# Altium schematic sheet USB3.0_1.SchDoc
size A3; SheetNumber: 16; SheetTotal: 18
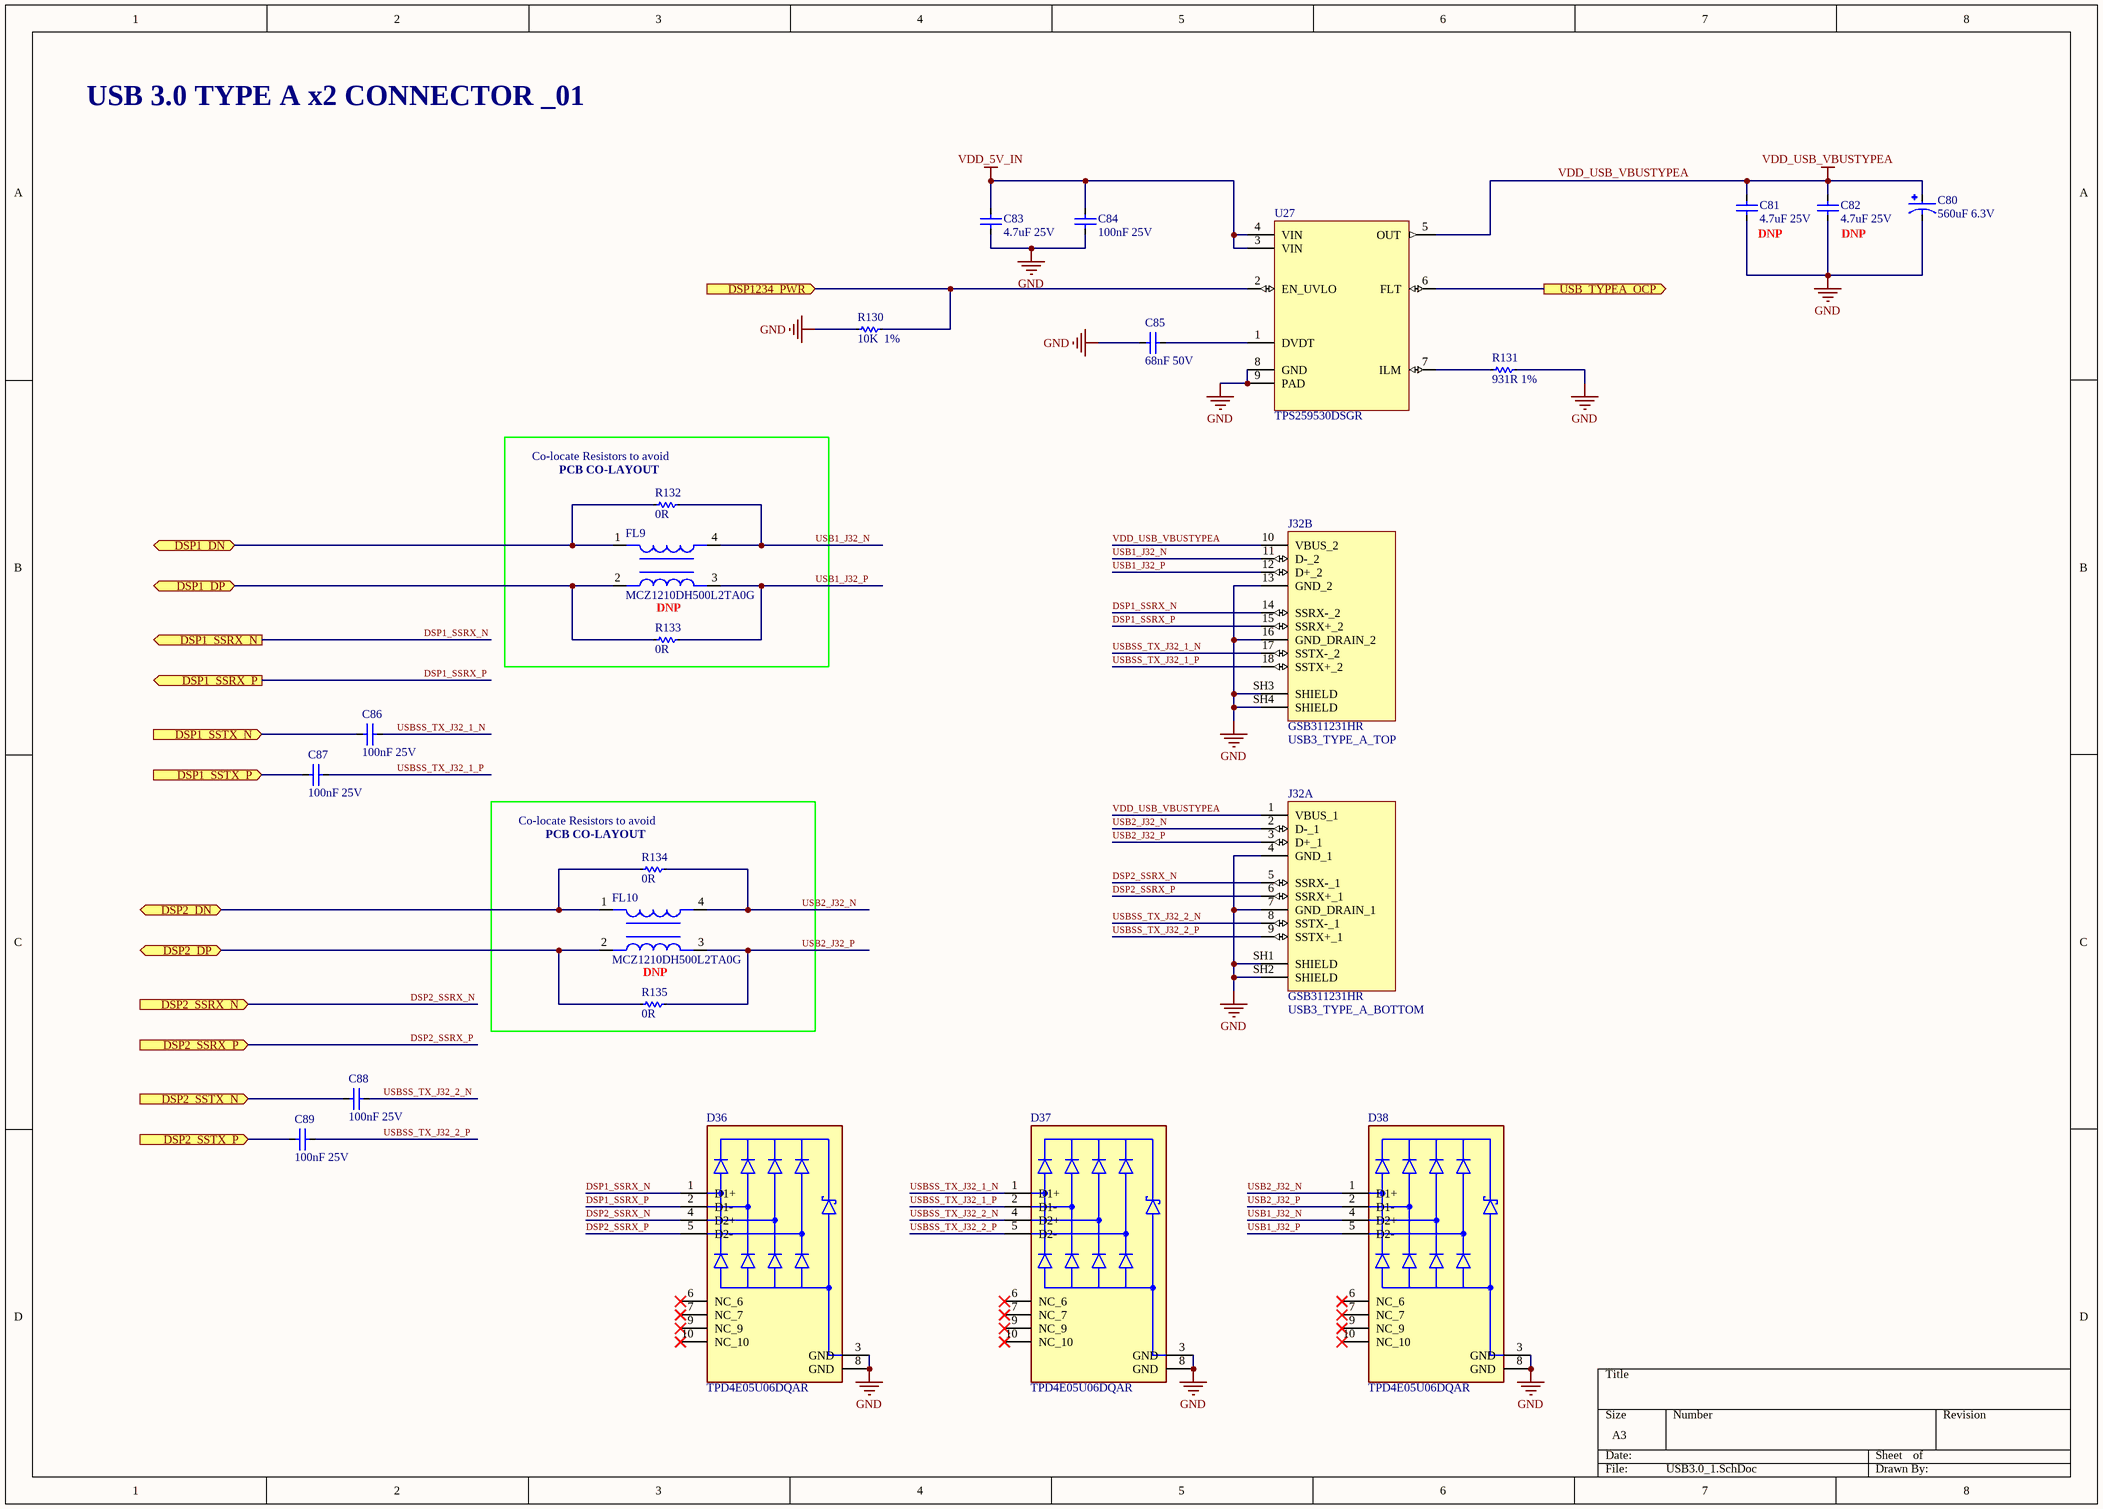
[diagram p0: USB3.0_1.SchDoc]

## Parts
C80  560uF 6.3V  [CP_ELEC_8X7.7]
C81  4.7uF 25V  [C0603]
C82  4.7uF 25V  [C0603]
C83  4.7uF 25V  [C0603]
C84  100nF 25V  [C0402]
C85  68nF 50V  [C0805]
C86  100nF 25V  [C0402]
C87  100nF 25V  [C0402]
C88  100nF 25V  [C0402]
C89  100nF 25V  [C0402]
D36  TPD4E05U06DQAR  [TPD4E05U06DQAR]
D37  TPD4E05U06DQAR  [TPD4E05U06DQAR]
D38  TPD4E05U06DQAR  [TPD4E05U06DQAR]
FL9  MCZ1210DH500L2TA0G  [MCZ1210DH500L2TA0G]
FL10  MCZ1210DH500L2TA0G  [MCZ1210DH500L2TA0G]
J32  GSB311231HR  [GSB311231HR]  (parts A,B of 2)
R130  10K  1%  [R0402]
R131  931R 1%  [R0402]
R132  0R  [R0402]
R133  0R  [R0402]
R134  0R  [R0402]
R135  0R  [R0402]
U27  TPS259530DSGR  [WSON(2X2)-8]

## Ports
DSP1_DN (bidir), DSP1_DP (bidir), DSP1_SSRX_N (out), DSP1_SSRX_P (out), DSP1_SSTX_N (in), DSP1_SSTX_P (in), DSP2_DN (bidir), DSP2_DP (bidir), DSP2_SSRX_N (in), DSP2_SSRX_P (in), DSP2_SSTX_N (in), DSP2_SSTX_P (in), DSP1234_PWR (in), USB_TYPEA_OCP (out)

## Nets
GND: C80.2(C) C81.1 C82.1 C83.1 C84.1 C85.1 D36.3(GND) D36.8(GND) D37.3(GND) D37.8(GND) D38.3(GND) D38.8(GND) J32.4(GND_1) J32.7(GND_DRAIN_1) J32.13(GND_2) J32.16(GND_DRAIN_2) J32.SH1(SHIELD) J32.SH2(SHIELD) J32.SH3(SHIELD) J32.SH4(SHIELD) R130.1 R131.2 U27.8(GND) U27.9(PAD)
VDD_5V_IN: C83.2 C84.2 U27.3(VIN) U27.4(VIN)
VDD_USB_VBUSTYPEA: C80.1(A) C81.2 C82.2 J32.1(VBUS_1) J32.10(VBUS_2) U27.5(OUT)
DSP1_DN: FL9.1 R132.1 ; port DSP1_DN
DSP1_DP: FL9.2 R133.1 ; port DSP1_DP
DSP1_SSRX_N: D36.1(D1+) J32.14(SSRX-_2) ; port DSP1_SSRX_N
DSP1_SSRX_P: D36.2(D1-) J32.15(SSRX+_2) ; port DSP1_SSRX_P
DSP1_SSTX_N: C86.1 ; port DSP1_SSTX_N
DSP1_SSTX_P: C87.1 ; port DSP1_SSTX_P
DSP2_DN: FL10.1 R134.1 ; port DSP2_DN
DSP2_DP: FL10.2 R135.1 ; port DSP2_DP
DSP2_SSRX_N: D36.4(D2+) J32.5(SSRX-_1) ; port DSP2_SSRX_N
DSP2_SSRX_P: D36.5(D2-) J32.6(SSRX+_1) ; port DSP2_SSRX_P
DSP2_SSTX_N: C88.1 ; port DSP2_SSTX_N
DSP2_SSTX_P: C89.1 ; port DSP2_SSTX_P
DSP1234_PWR: R130.2 U27.2(EN_UVLO) ; port DSP1234_PWR
USB1_J32_N: D38.4(D2+) FL9.4 J32.11(D-_2) R132.2
USB1_J32_P: D38.5(D2-) FL9.3 J32.12(D+_2) R133.2
USB2_J32_N: D38.1(D1+) FL10.4 J32.2(D-_1) R134.2
USB2_J32_P: D38.2(D1-) FL10.3 J32.3(D+_1) R135.2
USB_TYPEA_OCP: U27.6(FLT) ; port USB_TYPEA_OCP
USBSS_TX_J32_1_N: C86.2 D37.1(D1+) J32.17(SSTX-_2)
USBSS_TX_J32_1_P: C87.2 D37.2(D1-) J32.18(SSTX+_2)
USBSS_TX_J32_2_N: C88.2 D37.4(D2+) J32.8(SSTX-_1)
USBSS_TX_J32_2_P: C89.2 D37.5(D2-) J32.9(SSTX+_1)
NetC85_2: C85.2 U27.1(DVDT)
NetR131_1: R131.1 U27.7(ILM)

Not connected (* = marked no-connect by the designer): D36 6(NC_6)* 7(NC_7)* 9(NC_9)* 10(NC_10)*; D37 6(NC_6)* 7(NC_7)* 9(NC_9)* 10(NC_10)*; D38 6(NC_6)* 7(NC_7)* 9(NC_9)* 10(NC_10)*

## Notes on the sheet
- USB 3.0 TYPE A x2 CONNECTOR _01
- (near C81) DNP
- (near C82) DNP
- (near R132) Co-locate Resistors to avoid
- (near R132) PCB CO-LAYOUT
- DNP
- (near J32) USB3_TYPE_A_TOP
- (near R134) Co-locate Resistors to avoid
- (near R134) PCB CO-LAYOUT
- (near J32) USB3_TYPE_A_BOTTOM

## Library data of the parts
C80 = RHA0J561MCN1GS: Cap Aluminum Polymer 560uF 6.3VDC 20% (8 X 7.7mm) SMD 0.009 Ohm 4500mA 2000h 105C T/R; Manufacturer: Nichicon; ESR (Equivalent Series Resistance): 9mR; Life (Hours): 2000Hour; Ripple Current: 4.5A; Leakage Current: 1.0584mA; Dissipation Factor: 0.12%; Supplier 1: Digi-Key; Manufacturer Part Number: RHA0J561MCN1GS; RoHS: Yes; Category: Polymer Capacitors; Stock 1: 37081; Pricing 1: 1=1.16000, 10=0.88500, 50=0.73500, 100=0.63290 (USD); Mount: Surface Mount; Case/Package: Radial; Min Operating Temperature: -55°C; Max Operating Temperature: 105°C; Capacitance: 560uF; Tolerance: 20%; Voltage Rating: 6.3V; Packaging: Tape and Reel; Package Quantity: 1; Voltage Rating (DC): 6.3V; Termination: SMD/SMT; Series: FPCAP, HA; Construction: Cylindrical; Diameter: 8mm; Length: 7.7mm; Width: 8.3mm; Height: 8.3mm; Height - Seated (Max): 0.303inch; Radiation Hardening: No; RoHS Compliant: Yes; ComponentLink1URL: https://datasheet.ciiva.com/16481/2009fpcap-catalog-hsha-16481370.pdf?src-supplier=Future+Electronics; ComponentLink1Description: https://datasheet.ciiva.com/16481/2009fpcap-catalog-hsha-16481370.pdf?src-supplier=Future+Electronics; ComponentLink2URL: https://datasheet.ciiva.com/101/e-hs-ha-101946.pdf?src-supplier=Digi-Key; ComponentLink2Description: https://datasheet.ciiva.com/101/e-hs-ha-101946.pdf?src-supplier=Digi-Key; ComponentLink3URL: https://datasheet.ciiva.com/101/e-hs-ha-101947.pdf?src-supplier=Digi-Key; ComponentLink3Description: https://datasheet.ciiva.com/101/e-hs-ha-101947.pdf?src-supplier=Digi-Key; ComponentLink4URL: https://datasheet.ciiva.com/101/e-hs-ha-101948.pdf?src-supplier=Digi-Key; ComponentLink4Description: https://datasheet.ciiva.com/101/e-hs-ha-101948.pdf?src-supplier=Digi-Key; Supplier Part Number 1: 493-3772-1-ND
C81-C83 = GRM188R61E475KE11D: 0603 4.7 uF 25 V ±10 % Tolerance X5R SMT Multilayer Ceramic Capacitor; Manufacturer: Murata; Tolerance: 10%; Supplier 1: Digi-Key; Manufacturer Part Number: GRM188R61E475KE11D; RoHS: Yes; Category: Ceramic Capacitors; Stock 1: 1144167; Pricing 1: 1=0.26000, 10=0.18000, 50=0.12000, 100=0.10200, 500=0.07202, 1000=0.06301 (USD); Mount: Surface Mount; Case/Package: 0603; Case Code (Metric): 1608; Case Code (Imperial): 0603; Material: Ceramic; Min Operating Temperature: -55°C; Max Operating Temperature: 85°C; Package Quantity: 1; Packaging: Cut Tape; Capacitance: 4.7uF; Voltage Rating: 25V; Dielectric: X5R; Voltage: 25V; Voltage Rating (DC): 25V; Series: GRM; Length: 0.063inch; Width: 0.031inch; Height: 0.8mm; Thickness: 0.031inch; Depth: 0.8mm; Reach SVHC Compliant: Yes; Lead Free: Lead Free; RoHS Compliant: Yes; ComponentLink1URL: https://datasheet.ciiva.com/46444/1769893-46444983.pdf?src-supplier=Element14; ComponentLink1Description: https://datasheet.ciiva.com/46444/1769893-46444983.pdf?src-supplier=Element14; ComponentLink2URL: https://datasheet.ciiva.com/46444/1769893-46444982.pdf?src-supplier=Element14; ComponentLink2Description: https://datasheet.ciiva.com/46444/1769893-46444982.pdf?src-supplier=Element14; ComponentLink3URL: https://datasheet.ciiva.com/14891/partnumbering-e-01-14891103.pdf?src-supplier=Digi-Key; ComponentLink3Description: https://datasheet.ciiva.com/14891/partnumbering-e-01-14891103.pdf?src-supplier=Digi-Key; ComponentLink4URL: https://datasheet.ciiva.com/14891/partnumbering-e-01-14891102.pdf?src-supplier=Digi-Key; ComponentLink4Description: https://datasheet.ciiva.com/14891/partnumbering-e-01-14891102.pdf?src-supplier=Digi-Key; Supplier Part Number 1: 490-7203-1-ND
C84 = TMK105BJ104KV-F: CAP CER 0.1UF 25V X5R 0402 / High Value Multilayer Ceramic Capacitors (High dielectric type); Manufacturer: Taiyo Yuden; Tolerance: 10%; Supplier 1: Digi-Key; Manufacturer Part Number: TMK105BJ104KV-F; RoHS: Yes; Category: Ceramic Capacitors; Stock 1: 11997960; Pricing 1: 1=0.10000, 10=0.03700, 50=0.02000, 100=0.01630, 500=0.01166, 1000=0.00917, 2500=0.00833, 5000=0.00767 (USD); Mount: Surface Mount; Case/Package: 0402; Number of Pins: 2; Case Code (Imperial): 0402; Case Code (Metric): 1005; Weight: 2.3E-05oz; Min Operating Temperature: -55°C; Max Operating Temperature: 85°C; Capacitance: 100nF; Packaging: Tape and Reel; Dielectric: X5R; Voltage Rating (DC): 25V; Voltage Rating: 25V; Package Quantity: 1; Termination: SMD/SMT; Resistor Type: Ceramic; Voltage: 25V; Series: M; Construction: Flat; Length: 1mm; Width: 0.02inch; Height: 0.5mm; Depth: 0.5mm; Thickness: 0.022inch; Reach SVHC Compliant: Yes; Lead Free: Lead Free; Halogen Free: Halogen Free; RoHS Compliant: Yes; Supplier Part Number 1: 587-1456-1-ND
C85 = C0805C683K5RECAUTO7210: Cap Cer 0805 68NF 50V X7R 10%; Manufacturer: KEMET; Supplier 1: Digi-Key; Manufacturer Part Number: C0805C683K5RECAUTO7210; Category: Ceramic Capacitors; Stock 1: 10000; Pricing 1: 1=0.25000, 10=0.17100, 50=0.11400, 100=0.09680, 500=0.06836, 1000=0.05981, 2500=0.05696, 5000=0.05269 (USD); RoHS Compliant: Yes; ComponentLink1URL: https://api.kemet.com/component-edge/download/datasheet/C0805C683K5RECAUTO7210.pdf?src-supplier=Digi-Key; ComponentLink1Description: https://api.kemet.com/component-edge/download/datasheet/C0805C683K5RECAUTO7210.pdf?src-supplier=Digi-Key; Supplier Part Number 1: 399-C0805C683K5RECAUTO7210CT-ND
C86-C89 = 04023C104KAT2A: 0402 100 nF 25 V ±10 % Tolerance X7R Surface Mount Multilayer Ceramic Capacitor; Manufacturer: Kyocera AVX; Tolerance: 10%; Supplier 1: Digi-Key; Manufacturer Part Number: 04023C104KAT2A; RoHS: Yes; Category: Ceramic Capacitors; Stock 1: 3248475; Pricing 1: 1=0.10000, 10=0.03300, 50=0.01820, 100=0.01480, 500=0.01060, 1000=0.00833, 2500=0.00758, 5000=0.00697 (USD); Mount: Surface Mount; Case/Package: 0402; Number of Pins: 2; Case Code (Metric): 1005; Case Code (Imperial): 0402; Min Operating Temperature: -55°C; Max Operating Temperature: 125°C; Capacitance: 100nF; Packaging: Cut Tape; Dielectric: X7R; Voltage Rating (DC): 25V; Voltage Rating: 25V; Package Quantity: 1; Termination: SMD/SMT; Voltage: 25V; Series: -; Construction: Flat; Length: 1mm; Width: 1mm; Thickness: 0.022inch; Depth: 0.5mm; Radiation Hardening: No; Reach SVHC Compliant: Yes; Lead Free: Lead Free; RoHS Compliant: Yes; ComponentLink1URL: https://datasheet.ciiva.com/1123/1679506-1123344.pdf?src-supplier=Element14; ComponentLink1Description: https://datasheet.ciiva.com/1123/1679506-1123344.pdf?src-supplier=Element14; ComponentLink2URL: https://datasheet.ciiva.com/7614/cx7r-7614663.pdf?src-supplier=Digi-Key; ComponentLink2Description: https://datasheet.ciiva.com/7614/cx7r-7614663.pdf?src-supplier=Digi-Key; ComponentLink3URL: https://datasheet.ciiva.com/7709/1679506-7709527.pdf?src-supplier=Element14; ComponentLink3Description: https://datasheet.ciiva.com/7709/1679506-7709527.pdf?src-supplier=Element14; ComponentLink4URL: https://datasheet.ciiva.com/6265/cx7r-6265272.pdf?src-supplier=Digi-Key; ComponentLink4Description: https://datasheet.ciiva.com/6265/cx7r-6265272.pdf?src-supplier=Digi-Key; ComponentLink5URL: https://datasheet.ciiva.com/14906/cx7r-14906223.pdf?src-supplier=Digi-Key; ComponentLink5Description: https://datasheet.ciiva.com/14906/cx7r-14906223.pdf?src-supplier=Digi-Key; Supplier Part Number 1: 478-7868-1-ND
D36-D38 = TPD4E05U06DQAR: Quad 0.5-pF, 5.5-V, ±12-kV ESD protection diode for USB, HDMI & High Speed Interfaces; Manufacturer: Texas Instruments; Direction: Unidirectional; Capacitance: 0.5pF; Number of Bidirectional Channels: 4; Reverse Standoff Voltage: 5.5V; Min Breakdown Voltage: 6V; Clamping Voltage: 14V; Peak Pulse Power: 40W; Power Line Protection: Yes; Leakage Current: 10nA; Peak Pulse Current: 2.5A; Interface: LVDS,USB,Ethernet,HDMI,PCIe,SATA; Supplier 1: Mouser; Manufacturer Part Number: TPD4E05U06DQAR; RoHS: Yes; Category: Integrated Circuits (ICs); Stock 1: 71744; Pricing 1: 1=0.66000, 10=0.58100, 50=0.54600, 100=0.44600, 1000=0.28200, 10000=0.25500 (USD); Mount: Surface Mount; Case/Package: SON; Number of Pins: 10; Contact Plating: Gold; Min Operating Temperature: -40°C; Max Operating Temperature: 125°C; Packaging: Tape and Reel; Package Quantity: 3000; Polarity: Unidirectional; Number of Channels: 4; Breakdown Voltage: 6V; Max Power Dissipation: 40W; Termination: SMD/SMT; Working Voltage: 5.5V; Operating Supply Voltage: 5.5V; Series: -; Number of Unidirectional Channels: 4; Length: 2.6mm; Depth: 1.1mm; Radiation Hardening: No; Reach SVHC Compliant: Yes; Lead Free: Lead Free; RoHS Compliant: Yes; ComponentLink1URL: https://datasheet.ciiva.com/15063/tpd4e05u06-15063653.pdf?src-supplier=Digi-Key; ComponentLink1Description: https://datasheet.ciiva.com/15063/tpd4e05u06-15063653.pdf?src-supplier=Digi-Key; ComponentLink2URL: https://datasheet.ciiva.com/24119/slvsbo7f-316827-24119436.pdf?src-supplier=Mouser; ComponentLink2Description: https://datasheet.ciiva.com/24119/slvsbo7f-316827-24119436.pdf?src-supplier=Mouser; ComponentLink3URL: https://datasheet.ciiva.com/26918/getdatasheetpartid-716763-26918024.pdf?src-supplier=Verical; ComponentLink3Description: https://datasheet.ciiva.com/26918/getdatasheetpartid-716763-26918024.pdf?src-supplier=Verical; ComponentLink4URL: https://datasheet.ciiva.com/15063/tpd4e05u06-15063654.pdf?src-supplier=Digi-Key; ComponentLink4Description: https://datasheet.ciiva.com/15063/tpd4e05u06-15063654.pdf?src-supplier=Digi-Key; ComponentLink5URL: https://datasheet.ciiva.com/15063/tpd4e05u06-15063655.pdf?src-supplier=Digi-Key; ComponentLink5Description: https://datasheet.ciiva.com/15063/tpd4e05u06-15063655.pdf?src-supplier=Digi-Key; ComponentLink6URL: https://datasheet.ciiva.com/29883/tpd4e05u06-29883798.pdf?src-supplier=Avnet; ComponentLink6Description: https://datasheet.ciiva.com/29883/tpd4e05u06-29883798.pdf?src-supplier=Avnet; Supplier Part Number 1: 595-TPD4E05U06DQAR
FL9 FL10 = MCZ1210DH500L2TA0G: 2 Line Common Mode Choke Surface Mount 50 Ohms 100mA DCR 2.5Ohm; Manufacturer: TDK; Number of Lines: 2; DC Resistance (DCR): 2.5R; Voltage Rating (DC): 5V; Supplier 1: Mouser; Manufacturer Part Number: MCZ1210DH500L2TA0G; RoHS: Yes; Category: Common Mode Chokes; Stock 1: 8170; Pricing 1: 1=0.64000, 10=0.62200, 50=0.62200, 100=0.49900, 1000=0.33900, 10000=0.24500 (USD); Mount: Surface Mount; Case Code (Metric): 3225; Case Code (Imperial): 1210; Min Operating Temperature: -40°C; Max Operating Temperature: 85°C; Packaging: Tape and Reel; Max Current Rating: 100mA; Length: 0.049inch; Width: 0.039inch; Height: 0.024inch; RoHS Compliant: Yes; ComponentLink1URL: https://product.tdk.com/info/en/catalog/datasheets/cmf_commercial_signal_mcz1210dh_en.pdf?ref_disty=digikey&src-supplier=Digi-Key; ComponentLink1Description: https://product.tdk.com/info/en/catalog/datasheets/cmf_commercial_signal_mcz1210dh_en.pdf?ref_disty=digikey&src-supplier=Digi-Key; Supplier Part Number 1: 810-MCZ1210DH500L2TG
J32 = GSB311231HR: 18 Position USB TYPE-A Panel Mount Through Hole Right Angle Receptacle Connector; Manufacturer: Amphenol Communications Solutions; Supplier 1: Digi-Key; Manufacturer Part Number: GSB311231HR; RoHS: No; Category: Connectors; Stock 1: 6819; Pricing 1: 1=3.39000, 10=3.08200, 25=2.91880, 40=2.85075, 100=2.71510, 300=2.37570, 500=2.30782, 1000=1.96843, 2400=1.83268 (USD); Supplier Part Number 1: GSB311231HR-ND; ComponentLink1Description: Datasheet; ComponentLink1URL: https://www.amphenol-cs.com/media/wysiwyg/files/drawing/gsb311231hr.pdf
R130 = RC0402FR-0710KP: Res General Purpose Thick Film 0402 10K Ohm 1% 1/16W ±100ppm/°C Molded SMD Paper T/R; Manufacturer: Yageo; Resistance: 10kR; Max Power Dissipation: 63mW; Temperature Coefficient: 150ppm/°C; Supplier 1: Digi-Key; Manufacturer Part Number: RC0402FR-0710KP; RoHS: Yes; Category: Chip SMD Resistors; Stock 1: 1032587; Pricing 1: 1=0.10000, 10=0.03100, 100=0.01280, 1000=0.00573, 2500=0.00497, 5000=0.00411 (USD); Case/Package: 0402; Case Code (Metric): 1005; Case Code (Imperial): 0402; Min Operating Temperature: -55°C; Max Operating Temperature: 155°C; Packaging: Tape and Reel; Resistor Type: Thick Film; Number of Terminations: 2; Tolerance: 1%; Features: Moisture Resistant; Length: 0.039inch; Width: 0.02inch; Height: 0.016inch; RoHS Compliant: Yes; ComponentLink1URL: http://www.yageo.com/NewPortal/yageodocoutput?fileName=/pdf/R-Chip/PYu-RC_51_RoHS_P_0.pdf&src-supplier=Digi-Key; ComponentLink1Description: http://www.yageo.com/NewPortal/yageodocoutput?fileName=/pdf/R-Chip/PYu-RC_51_RoHS_P_0.pdf&src-supplier=Digi-Key; Supplier Part Number 1: YAG1249CT-ND
R131 = RC0402FR-07931RL: Res Thick Film 0402 931 Ohm 1% 1/16W ±100ppm/°C Molded SMD Paper T/R; Manufacturer: Yageo; Voltage Rating: 50V; Power Rating: 62.5mW; Max Power Dissipation: 63mW; Supplier 1: Digi-Key; Manufacturer Part Number: RC0402FR-07931RL; RoHS: Yes; Category: Chip SMD Resistors; Stock 1: 184106; Pricing 1: 1=0.10000, 10=0.01400, 100=0.00580, 1000=0.00262, 2500=0.00228, 5000=0.00188 (USD); Case/Package: 0402; Case Code (Imperial): 0402; Case Code (Metric): 1005; Contact Plating: Tin,Matte; Size Code: 0402; Min Operating Temperature: -55°C; Max Operating Temperature: 155°C; Resistance: 931R; Tolerance: 1%; Packaging: Tape and Reel; Resistor Type: Thick Film; Number of Terminations: 2; Termination: SMD/SMT; Temperature Coefficient: 100ppm/°C; Voltage Rating (DC): 50V; Features: Moisture Resistant; Series: RC; Construction: Rectangular; Length: 1mm; Width: 0.02inch; Height: 0.016inch; Depth: 0.5mm; Military Standard: Not; Lead Free: Lead Free; RoHS Compliant: Yes; ComponentLink1URL: https://datasheet.ciiva.com/16931/pyu-rc0402-51-rohs-l-6-r-16931231.pdf?src-supplier=Future+Electronics; ComponentLink1Description: https://datasheet.ciiva.com/16931/pyu-rc0402-51-rohs-l-6-r-16931231.pdf?src-supplier=Future+Electronics; Supplier Part Number 1: YAG3259CT-ND
R132-R135 = RC0402JR-070RP: Res Jumper Thick Film 0402 0 Ohm 5% 1/16W Molded SMD Paper T/R; Manufacturer: Yageo; Resistance: 0mR; Max Power Dissipation: 63mW; Supplier 1: Digi-Key; Manufacturer Part Number: RC0402JR-070RP; RoHS: Yes; Category: Chip SMD Resistors; Stock 1: 5886851; Pricing 1: 1=0.10000, 10=0.02300, 25=0.01640, 50=0.01240, 100=0.00920, 250=0.00700, 500=0.00560, 1000=0.00412, 5000=0.00296 (USD); Case/Package: 0402; Case Code (Metric): 1005; Case Code (Imperial): 0402; Min Operating Temperature: -55°C; Max Operating Temperature: 155°C; Packaging: Tape and Reel; Resistor Type: Thick Film; Number of Terminations: 2; Features: Moisture Resistant; Length: 0.039inch; Width: 0.02inch; Height: 0.016inch; RoHS Compliant: Yes; ComponentLink1URL: http://www.yageo.com/NewPortal/yageodocoutput?fileName=/pdf/R-Chip/PYu-RC_51_RoHS_P_0.pdf&src-supplier=Digi-Key; ComponentLink1Description: http://www.yageo.com/NewPortal/yageodocoutput?fileName=/pdf/R-Chip/PYu-RC_51_RoHS_P_0.pdf&src-supplier=Digi-Key; Supplier Part Number 1: YAG1279CT-ND
U27 = TPS259530DSGR: TPS259530 12V eFuse with Fast Overvoltage Protection 2.7V to 18V 4A 34m Ohm 8-Pin WSON T/R; Manufacturer: Texas Instruments; Number of Channels: 1; Accuracy: 7.5%; Supplier 1: Mouser; Manufacturer Part Number: TPS259530DSGR; RoHS: Yes; Category: Integrated Circuits (ICs); Stock 1: 11629; Pricing 1: 1=0.97000, 10=0.87000, 50=0.82500, 100=0.67800, 1000=0.44200, 10000=0.42700 (USD); Mount: Surface Mount; Min Operating Temperature: -40°C; Max Operating Temperature: 125°C; Packaging: Tape and Reel; Output Current: 4A; RoHS Compliant: Yes; ComponentLink1URL: https://www.ti.com/lit/ds/symlink/tps2595.pdf?ts=1676530042371&ref_url=https%253A%252F%252Fwww.ti.com%252Fproduct%252FTPS2595%252Fpart-details%252FTPS259530DSGR; ComponentLink1Description: Datasheet; Supplier Part Number 1: 595-TPS259530DSGR